# Altium project tractive_light.PrjPcb
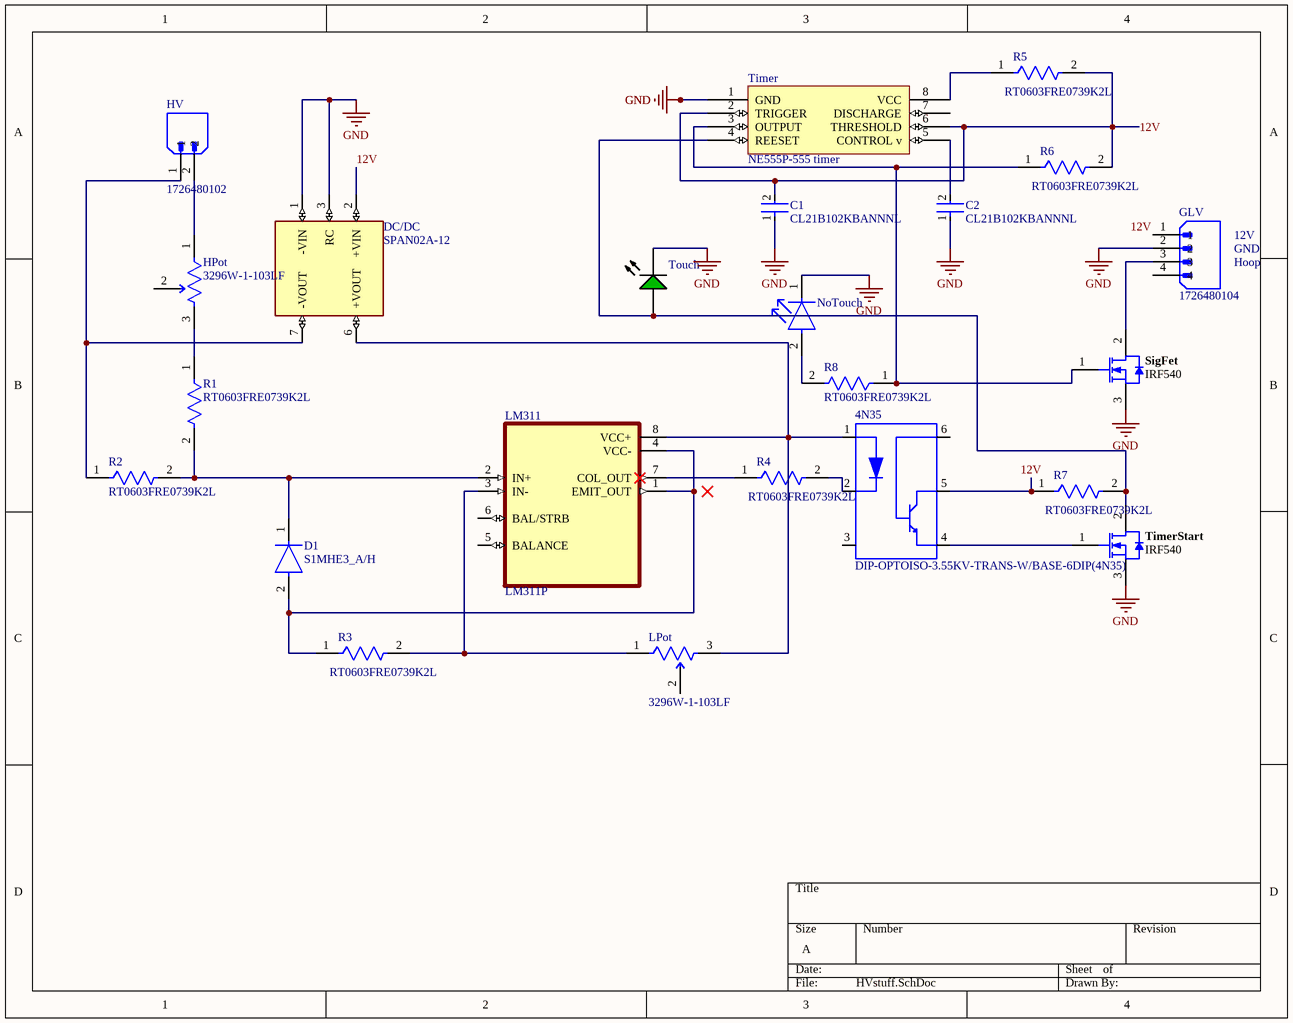
[diagram p0: HVstuff.SchDoc]
1 sheet, 23 parts. Net scope: global (net labels, ports and power ports of the same name join across sheets).
Board file: HVstuffPCB.PcbDoc

## Sheet HVstuff.SchDoc
size A; SheetNumber: 1; SheetTotal: 1

### Parts
4N35  DIP-OPTOISO-3.55KV-TRANS-W/BASE-6DIP(4N35)  [DIP6-2.54-7.3X6.5MM]
C1  CL21B102KBANNNL  [FP-CL21-IPC_A]
C2  CL21B102KBANNNL  [FP-CL21-IPC_A]
D1  S1MHE3_A/H  [FP-SMA-MFG]
DC/DC  SPAN02A-12  [SPAN02]
GLV  1726480104  [MOLEX_1726480104]
HPot  3296W-1-103LF  [FP-3296W-MFG]
HV  1726480102  [MOLEX_1726480102]
LM311  LM311P  [DIP794W45P254L959H508Q8]
LPot  3296W-1-103LF  [FP-3296W-MFG]
NoTouch  HSMS-C170  [FP-HSMS-C170-MFG]  (value not drawn)
R1  RT0603FRE0739K2L  [FP-RT0603-MFG]
R2  RT0603FRE0739K2L  [FP-RT0603-MFG]
R3  RT0603FRE0739K2L  [FP-RT0603-MFG]
R4  RT0603FRE0739K2L  [FP-RT0603-MFG]
R5  RT0603FRE0739K2L  [FP-RT0603-MFG]
R6  RT0603FRE0739K2L  [FP-RT0603-MFG]
R7  RT0603FRE0739K2L  [FP-RT0603-MFG]
R8  RT0603FRE0739K2L  [FP-RT0603-MFG]
SigFet  IRF540  [VISH-TO-220AB-3_A]
Timer  NE555P-555 timer  [NE555P-555 timer-Footprint-1]
TimerStart  IRF540  [VISH-TO-220AB-3_A]
Touch  HSMG-C170  [AVAG-HSMX-C170_V]  (value not drawn)

### Nets
GND: C1.1 C2.1 DC/DC.1(-VIN) DC/DC.3(RC) GLV.2 NoTouch.1(C) SigFet.3(S) Timer.1(GND) TimerStart.3(S) Touch.2(K)
12V: 4N35.5(COLLECTOR) C1.2 DC/DC.2(+VIN) GLV.1 R5.2 R6.2 R7.1 Timer.2(TRIGGER) Timer.6(THRESHOLD)
Net4N35_1: 4N35.1(ANODE) DC/DC.6(+VOUT) LM311.8(VCC+) LPot.3(CW)
Net4N35_2: 4N35.2(CATHODE) R4.2
Net4N35_4: 4N35.4(EMITER) TimerStart.1(G)
NetC2_2: C2.2 Timer.5(CONTROL_v)
NetD1_1: D1.1(C) LM311.2(IN+) R1.2 R2.2
NetD1_2: D1.2(A) LM311.1(EMIT_OUT) LM311.4(VCC-) R3.1
NetDC/DC_7: DC/DC.7(-VOUT) HV.1 R2.1
NetGLV_3: GLV.3 SigFet.2(D)
NetHPot_1: HPot.1(CCW) HV.2
NetHPot_3: HPot.3(CW) R1.1
NetLM311_3: LM311.3(IN-) LPot.1(CCW) R3.2
NetLM311_7: LM311.7(COL_OUT) R4.1
NetNoTouch_2: NoTouch.2(A) R8.2
NetR5_1: R5.1 Timer.8(VCC)
NetR6_1: R6.1 R8.1 SigFet.1(G) Timer.3(OUTPUT)
NetR7_2: R7.2 Timer.4(REESET) TimerStart.2(D) Touch.1(A)

Not connected (* = marked no-connect by the designer): 4N35 3(NC) 6(BASE); GLV 4; HPot 2(WIPER); LM311 5(BALANCE) 6(BAL/STRB); LPot 2(WIPER); Timer 7(DISCHARGE)

### Notes on the sheet
- 12V
- GND
- Hoop

### Library data of the parts
4N35 = DIP-OPTOISO-3.55KV-TRANS-W/BASE-6DIP(4N35): Optoisolator Transistor with Base Output 5000Vrms 1 Channel 6-DIP; MF: Vishay; Purchase-URL: https://pricing.snapeda.com/search/part/4N35/?ref=eda; Price: None; SnapEDA_Link: https://www.snapeda.com/parts/4N35/Vishay%20Semiconductor%20Opto%20Division/view-part/579099/?ref=snap; MP: 4N35; Availability: Good; Value: *; Check_prices: https://www.snapeda.com/parts/4N35/Vishay%20Semiconductor%20Opto%20Division/view-part/579099/?ref=eda; Package: DIP-6 Texas Instruments
C1 C2 = CMP-13271-003493-1: CL21 Series 0805 1nF 50V ±10% Tolerance X7R Multilayer Ceramic Chip Capacitor; Tolerance: 10%; Mount: Surface Mount; Length: 2mm; Thickness: 0.03inch; Depth: 1.25mm; Radiation Hardening: No; Voltage: 50V; Case/Package: 0805; Max Operating Temperature: 125°C; Min Operating Temperature: -55°C; Voltage Rating (DC): 50V; Dielectric: X7R; Voltage Rating: 50V; Packaging: Tape and Reel; Capacitance: 1nF; Lead Free: Lead Free; Width: 0.049inch; Height: 0.65mm; Package Quantity: 15000
D1 = CMP-02540-000086-1: DIODE GEN PURP 1KV 1A DO214AC; Forward Voltage: 1.1V; Reverse Recovery Time: 1.8us; Peak Non-Repetitive Surge Current: 30A; Max Operating Temperature: 150°C; RoHS Compliant: Yes; Series: -; Number of Pins: 2; Packaging: Tape and Reel; Case/Package: SMA; Max Reverse Voltage (DC): 1kV; Min Operating Temperature: -55°C; Average Rectified Current: 1A; Mount: Surface Mount
DC/DC = SPAN02A-12: Isolated Module DC DC Converter 1 Output 12V - - - 167mA 9V - 18V Input; MF: MEAN WELL USA Inc.; SnapEDA_Link: https://www.snapeda.com/parts/SPAN02A-12/Mean+Well/view-part/?ref=snap; Package: SIP-8 MEAN WELL; Value: *; MP: SPAN02A-12; Check_prices: https://www.snapeda.com/parts/SPAN02A-12/Mean+Well/view-part/?ref=eda
GLV = 1726480104: Connector Header Through Hole, Right Angle 4 position 0.165in (4.20mm); Price: None; Availability: Unavailable; MP: 1726480104; Value: *; Package: None
HPot LPot = CMP-1747-00001-8: TRIMMER 10K OHM 0.5W PC PIN TOP; Number of Turns: 25; Tolerance: 10%; Resistance: 10kR; Max Power Dissipation: 500mW; Temperature Coefficient: 100ppm/°C; Insulation Resistance: 1GR; Min Operating Temperature: -55°C; Resistor Type: Cermet; Series: 3296; Color: Blue; Mount: Through Hole; Taper: Linear; Radiation Hardening: No; RoHS Compliant: Yes; Width: 9.53mm; Resistance Tolerance: 10%; Contact Plating: Tin; Military Standard: Not; Package Quantity: 50; Weight: 0.03oz; Lead Free: Lead Free; Power Rating: 500mW; Termination: Pin; Technology: CERMET; Max Operating Temperature: 125°C; Packaging: Rail/Tube; Length: 9.53mm; Depth: 4.83mm; Height: 11.55mm; Reach SVHC Compliant: Yes
HV = 1726480102: Connector Header Through Hole, Right Angle 2 position 0.165in (4.20mm); Package: None; Value: *; Price: None; Availability: Unavailable; MP: 1726480102
LM311 = LM311P: High Speed, 30V, Differential Comparator With Strobes 8-PDIP 0 to 70; MF: Texas Instruments; SnapEDA_Link: https://www.snapeda.com/parts/LM311P/Texas%20Instruments/view-part/2748658/?ref=snap; Availability: Good; MP: LM311P; Price: None; Texas_Instruments-Purchase-URL: https://snapeda.com/shop?store=Texas+Instruments&id=2748658; DigiKey-Purchase-URL: https://snapeda.com/shop?store=DigiKey&id=2748658; Package: PDIP-8 Texas Instruments; Mouser-Purchase-URL: https://snapeda.com/shop?store=Mouser&id=2748658; Value: *
NoTouch = CMP-18399-000018-1: LED RED DIFFUSED CHIP SMD; Forward Voltage: 2.1V; Shape: Rectangular; Wavelength: 626nm; Power Dissipation: 52mW; Reverse Voltage: 5V; Number of Elements: 1; Lens Color: White; Viewing Angle: 170°; Test Current: 20mA; Luminous Intensity: 10mcd; Number of Terminals: 2; Lead Free: Lead Free; Min Operating Temperature: -40°C; Package Quantity: 1; Depth: 1.25mm; Color: Red; Lens Style: Diffused; Mount: Surface Mount; Length: 2mm; Dominant Wavelength: 626nm; Packaging: Tape and Reel; Case Code (Metric): 2012; Max Operating Temperature: 85°C; Case Code (Imperial): 0805; Case/Package: 0805; Height: 0.8mm; Number of LEDs: 1; Illumination Color: Red; Width: 1.25mm; Radiation Hardening: No; Power Rating: 52mW; REACH SVHC: No SVHC; Number of Pins: 2; Lens Transparency: Diffused; Forward Current: 20mA
R1-R8 = CMP-2000-04739-2: RES SMD 39.2K OHM 1% 1/10W 0603; Manufacturer: Yageo; Temperature Coefficient: 50 ppm/°C; Resistance: 39.2KΩ; Tolerance: 0.01; Voltage Rating: 75V; Value: 39.2KΩ; Power Rating: 0.1W; ComponentLink2Description: Datasheet; Manufacturer Part Number: RT0603FRE0739K2L; Device Class L1: Passive Components; Temperature Range Low: -55°C; Package: RT0603; ComponentLink2URL: http://www.yageo.com/documents/recent/PYu-RT_1-to-0.01_RoHS_L_9.pdf; Device Class L2: Resistors; Octopart: https://octopart.com/rt0603fre0739k2l-yageo-1367269; Automotive: No; Digikey Description: RES SMD 39.2K OHM 1% 1/10W 0603; Temperature: -55°C to +155°C; Category: Res; Series: RT; RoHS: TRUE; Temperature Range High: +155°C; Device Class L3: Chip SMD Resistors; Composition: Thin Film; Height: 0.55mm; Footprint Url: http://www.yageo.com/exep/pages/download/literatures/PYu-R_Mount_10.pdf; Mouser Description: Thin Film Resistors - SMD 1/10W 39.2K ohm 1% 50ppm; Lead Free: Yes; Ipc Land Pattern Name: RESC16080X45
SigFet TimerStart = CMP-2000-06461-1: Power MOSFET, 100 VDS, -55 to 175 degC, 3-Pin TO-220AB, RoHS, Tube; Manufacturer: Vishay; Typical Turn-Off Delay Time: 53ns; Channel Mode: Enhancement; Unit Weight: 0.211644oz; Transistor Type: 1N-Channel; Vgs - Gate-Source Voltage: 20V; Transistor Polarity: N-Channel; Vds - Drain-Source Breakdown Voltage: 100V; Configuration: Single; Number of Channels: 1Channel; Pd - Power Dissipation: 150W; Brand: VishaySemiconductors; Rds On - Drain-Source Resistance: 77mOhms; Id - Continuous Drain Current: 28A; Rise Time: 44ns; Fall Time: 43ns; Typical Turn-On Delay Time: 11ns; &lt;PCN&gt;: http://www.mouser.com/PCN/Vishay_SIL_0182015.pdf; Maximum Operating Temperature: +175C; Product Category: MOSFET; Datasheet URL: http://www.vishay.com/docs/91021/91021.pdf; Length: 10.51mm; Height: 9.01mm; Factory Pack Quantity: 50; Width: 4.7mm; Packaging: Tube; Package Reference: TO-220AB-3; Package / Case: TO-220-3; Mounting Style: ThroughHole; Manufacturer URL: http://www.vishay.com/; Mounting Technology: ThroughHole; Package URL: http://www.vishay.com/docs/71195/to220ab.pdf; RoHS: NoRoHSVersionAvailable; Technology: Si; Minimum Operating Temperature: -55C; Package Description: 3-Pin Flange Mount, Body 10.275 x 4.45 mm, Pitch 2.54 mm; Datasheet Version: Rev. B, 03/2011
Timer = CMP-003-00030-1: 555 timer
Touch = CMP-2000-05062-1: Chip LED, Green, 2.2 V, -40 to 85 degC, 2-Pin SMD, Pb-Free, Tape and Reel; Manufacturer: Avago; No. of Pins: 2; Peak Wavelength: 570nm; SVHC: NoSVHC(16-Jun-2014); Dominant Wavelength: 572nm; Forward Current If: 20mA; Viewing Angle: 170deg; Lens Shape: Rectangular; PIV Max: 5V; External Width: 1.25mm; LED Type: Standard; External Depth: 0.8mm; Opto Mounting Orientation: Top; Luminous Intensity: 15mcd; Luminous Intensity Min: 4mcd; Forward Voltage VF Max: 2.6V; External Length / Height: 2mm; Bulb Size: 1.25mmx1.4mm; Light Area Height: 1mm; Voltage Vf Typ: 2.2V; Operating Temperature Max: 85degC; Datasheet Version: Oct-08; MSL: MSL2A-4weeks; Peak Forward Current: 20mA; Package Description: 2-Pin Surface Mount Device, Body 2 x 1.25 mm, Height 0.8 mm; Datasheet URL: https://datasheet.ciiva.com/29280/180495-da-01-en-chip-led-hsmg-c170-gelb-gruen-29280971.pdf; Storage Temperature Min: -40degC; LED Colour: Green; Wavelength Typ: 570nm; Mounting Type: SMD; Forward Current If Max: 20mA; Dominant Wavelength Typ: 572nm; LED Mounting: SMD; Operating Temperature Range: -30degCto+85degC; Operating Temperature Min: -30degC; Manufacturer URL: http://www.avagotech.com/; Packaging: CutTape; Luminous Intensity Typ: 15mcd; Package Reference: HSMX-C170; Storage Temperature Max: 85degC; Opto Case Style: SMD; Forward Voltage: 2.2V